# EAGLE design Meshtastic-DIY_v2 (EAGLE 9.6.2)
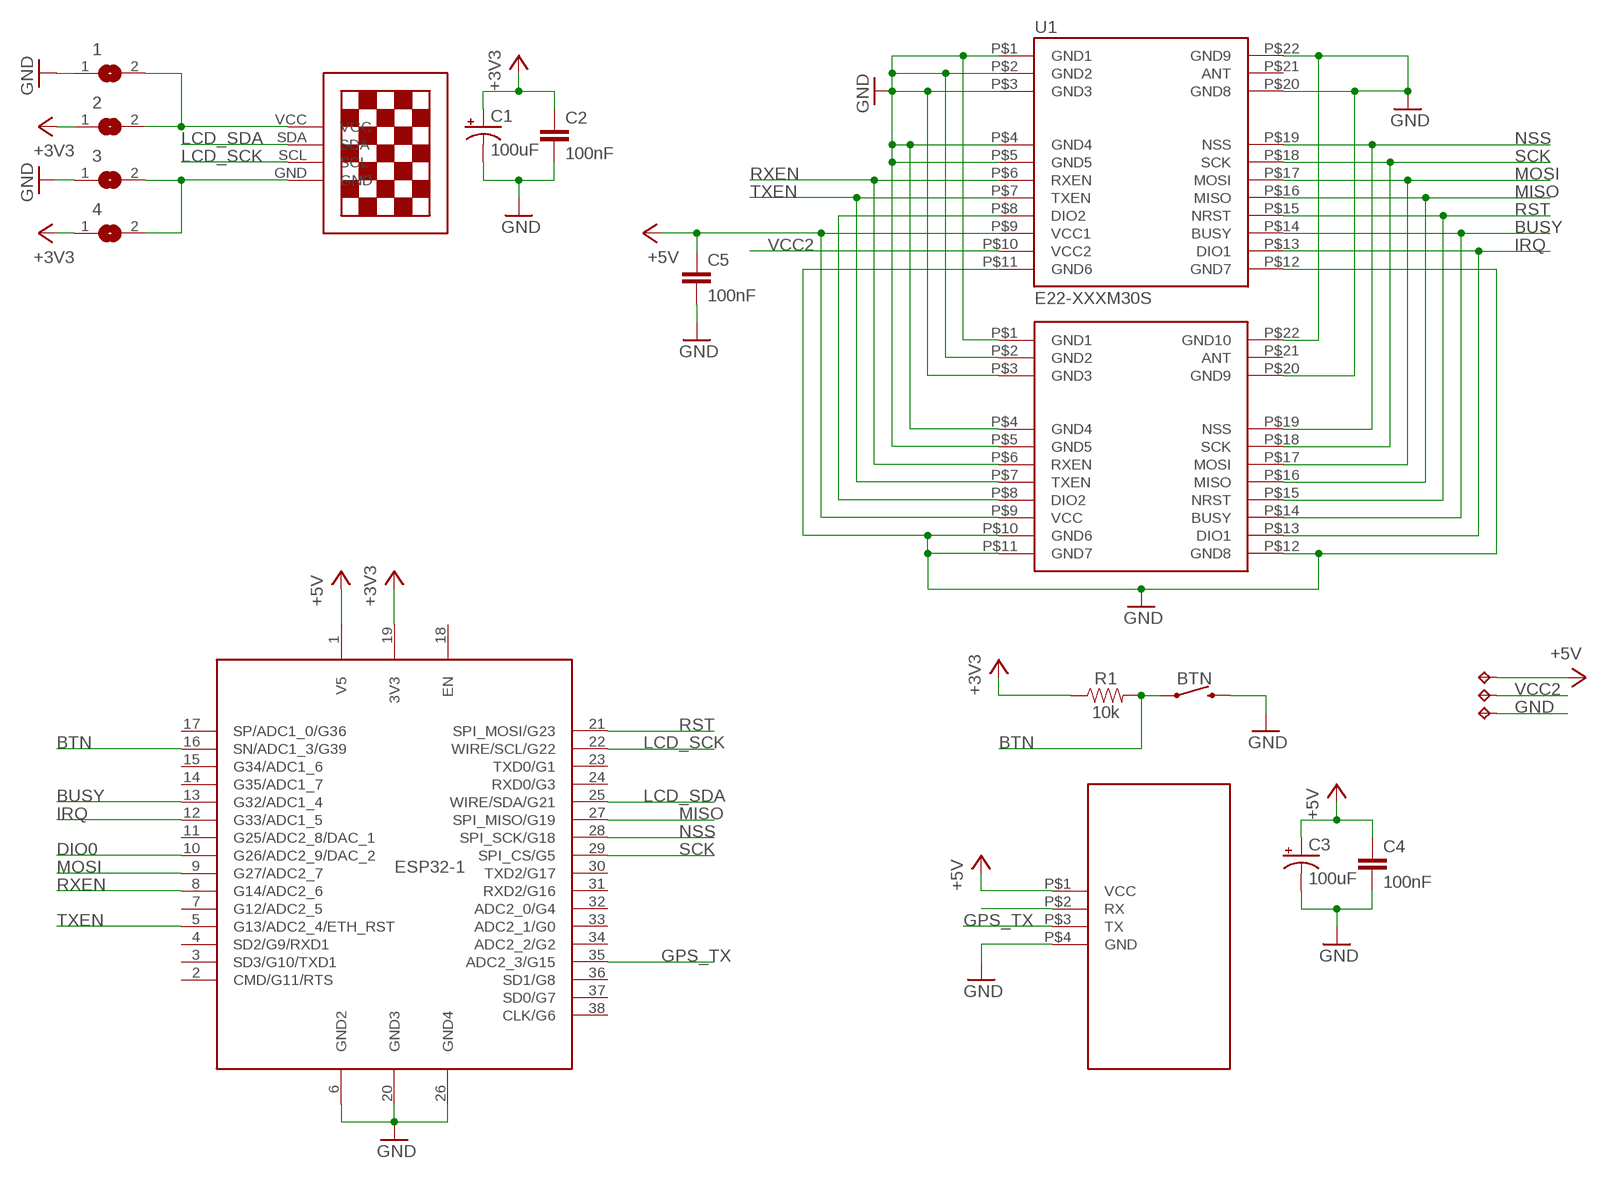
[diagram p0: schematic, sheet 1]

## Parts
1  SJ  [SJ]
2  SJ  [SJ]
3  SJ  [SJ]
4  SJ  [SJ]
BTN  MOMENTARY-SWITCH-SPST-PTH-6.0MM  [TACTILE_SWITCH_PTH_6.0MM]
C1  100uF  100UF-POLAR-EIA7343-10V-10%(TANT)  [EIA7343]
C2  100nF  0.33UF/330NF-0805-50V-10%  [0805]
C3  100uF  100UF-POLAR-EIA7343-10V-10%(TANT)  [EIA7343]
C4  100nF  0.33UF/330NF-0805-50V-10%  [0805]
C5  100nF  0.33UF/330NF-0805-50V-10%  [0805]
ESP32-1  NODEMCU_ESP32_WROOM_32  [NODEMCU_ESP32_WROOM_32--38PINS]
R1  10k  0.1OHM-1210-1/2W-1%  [1210]
TP1  TPTP14SQ  [TP14SQ]
TP2  TPTP14SQ  [TP14SQ]
TP3  TPTP14SQ  [TP14SQ]
U1  E22-XXXM30S  [E22-XXXM30S]
U$1  13"OLED13"OLED  [1.3"OLED]
U$2  E22-XXXM22S  [E22-XXXM22S]
U$3  GPS-NEO  [GPS-NEO]

## Nets
+3V3: 2.1 4.1 C1.A(+) C2.1 ESP32-1.19(3V3) R1.1
+5V: C3.A(+) C4.1 C5.1 ESP32-1.1(V5) TP1.TP U1.P$9(VCC1) U$2.P$9(VCC) U$3.P$1(VCC)
BTN: BTN.1 ESP32-1.16(SN/ADC1_3/G39) R1.2
BUSY: ESP32-1.13(G32/ADC1_4) U1.P$14(BUSY) U$2.P$14(BUSY)
DIO0: ESP32-1.10(G26/ADC2_9/DAC_2)
GND: 1.1 3.1 BTN.3 C1.C(-) C2.2 C3.C(-) C4.2 C5.2 ESP32-1.6(GND2) ESP32-1.20(GND3) ESP32-1.26(GND4) TP3.TP U1.P$1(GND1) U1.P$2(GND2) U1.P$3(GND3) U1.P$4(GND4) U1.P$5(GND5) U1.P$11(GND6) U1.P$12(GND7) U1.P$20(GND8) U1.P$22(GND9) U$2.P$1(GND1) U$2.P$2(GND2) U$2.P$3(GND3) U$2.P$4(GND4) U$2.P$5(GND5) U$2.P$10(GND6) U$2.P$11(GND7) U$2.P$12(GND8) U$2.P$20(GND9) U$2.P$22(GND10) U$3.P$4(GND)
GPS_TX: ESP32-1.35(ADC2_3/G15) U$3.P$3(TX)
IRQ: ESP32-1.12(G33/ADC1_5) U1.P$13(DIO1) U$2.P$13(DIO1)
LCD_SCK: ESP32-1.22(WIRE/SCL/G22) U$1.SCL
LCD_SDA: ESP32-1.25(WIRE/SDA/G21) U$1.SDA
MISO: ESP32-1.27(SPI_MISO/G19) U1.P$16(MISO) U$2.P$16(MISO)
MOSI: ESP32-1.9(G27/ADC2_7) U1.P$17(MOSI) U$2.P$17(MOSI)
N$1: 3.2 4.2 U$1.GND
N$3: U$3.P$2(RX)
N$4: 1.2 2.2 U$1.VCC
N$9: U1.P$8(DIO2) U$2.P$8(DIO2)
NSS: ESP32-1.28(SPI_SCK/G18) U1.P$19(NSS) U$2.P$19(NSS)
RST: ESP32-1.21(SPI_MOSI/G23) U1.P$15(NRST) U$2.P$15(NRST)
RXEN: ESP32-1.8(G14/ADC2_6) U1.P$6(RXEN) U$2.P$6(RXEN)
SCK: ESP32-1.29(SPI_CS/G5) U1.P$18(SCK) U$2.P$18(SCK)
TXEN: ESP32-1.5(G13/ADC2_4/ETH_RST) U1.P$7(TXEN) U$2.P$7(TXEN)
VCC2: TP2.TP U1.P$10(VCC2)
Unconnected: ESP32-1.3(SD3/G10/TXD1) ESP32-1.4(SD2/G9/RXD1) ESP32-1.7(G12/ADC2_5) ESP32-1.11(G25/ADC2_8/DAC_1) ESP32-1.14(G35/ADC1_7) ESP32-1.15(G34/ADC1_6) ESP32-1.17(SP/ADC1_0/G36) ESP32-1.18(EN) ESP32-1.23(TXD0/G1) ESP32-1.24(RXD0/G3) ESP32-1.30(TXD2/G17) ESP32-1.31(RXD2/G16) ESP32-1.32(ADC2_0/G4) ESP32-1.33(ADC2_1/G0) ESP32-1.34(ADC2_2/G2) ESP32-1.36(SD1/G8) ESP32-1.37(SD0/G7) ESP32-1.38(CLK/G6) U1.P$21(ANT) U$2.P$21(ANT)

## Power pins joined to a net without a drawn wire
CMD/G11/RTS: ESP32-1.2(CMD/G11/RTS)

## Library data of the parts
1-4 = jumper:SJ: SMD solder JUMPER
BTN = SparkFun-Switches:MOMENTARY-SWITCH-SPST: Momentary Switch (Pushbutton) - SPST Normally-open (NO) SPST momentary switches (buttons, pushbuttons). Variants PTH-12MM - 12mm square, through-hole Momentary Pushbutton Switch - 12mm Square <https://www.sparkfun.com/products/9190> (COM-09190) PTH-6.0MM, PTH-6.0MM-KIT - 6.0mm square, through-hole Mini Pushbutton Switch <https://www.sparkfun.com/products/97> (COM-00097) KIT package intended for soldering kit's - only one side of pads' copper is exposed. PTH-RIGHT-ANGLE-KIT - Right-angle, through-hole Right Angle Tactile Button <https://www.sparkfun.com/products/10791> - Used on SparkFun BigTime Watch Kit <https://www.sparkfun.com/products/11734> SMD-12MM - 12mm square, surface-mount Tactile Button - SMD (12mm) <https://www.sparkfun.com/products/12993> (COM-12993) Used on SparkFun PicoBoard <https://www.sparkfun.com/products/11888> SMD-4.5MM - 4.5mm Square Trackball Switch Used on SparkFun Blackberry Trackballer Breakout <https://www.sparkfun.com/products/13169> SMD-4.6MMX2.8MM - 4.60mm x 2.80mm, surface mount Used on SparkFun SAMD21 Mini Breakout <https://www.sparkfun.com/products/13664> SMD-5.2MM, SMD-5.2-REDUNDANT - 5.2mm square, surface-mount Mini Pushbutton Switch - SMD <https://www.sparkfun.com/products/8720> (COM-08720) Used on Arduino Pro Mini <https://www.sparkfun.com/products/11114> REDUNDANT package connects both switch circuits together SMD-6.0X3.5MM - 6.0 x 3.5mm, surface mount Momentary Reset Switch SMD <https://www.sparkfun.com/products/8229> (COM-08229) SMD-6.2MM-TALL - 6.2mm square, surface mount Tactile Button - SMD (6mm) <https://www.sparkfun.com/products/12992> Used on SparkFun Digital Sandbox <https://www.sparkfun.com/products/12651> SMD-RIGHT-ANGLE - Right-angle, surface mount Used on SparkFun Block for Intel® Edison - Arduino <https://www.sparkfun.com/products/13036>; PROD_ID: SWCH-08441; SF_SKU: COM-00097
C1 C3 = SparkFun-Capacitors:100UF-POLAR: 100µF polarized capacitors A capacitor is a passive two-terminal electrical component used to store electrical energy temporarily in an electric field.; PROD_ID: CAP-07890
C2 C4 C5 = SparkFun-Capacitors:0.33UF/330NF: 0.33µF/330nF ceramic capacitors A capacitor is a passive two-terminal electrical component used to store electrical energy temporarily in an electric field.; PROD_ID: CAP-08469; VALUE: 0.33µF
ESP32-1 = ESP32 NODEMCU WROOM 32:NODEMCU_ESP32_WROOM_32: NODEMCU ESP32 WROOM 32 38 Pins PINOUT: https://cdn.shopify.com/s/files/1/1509/1638/files/ESP_-_32_NodeMCU_Developmentboard_Pinout_Diagram.jpg?4479111012146266271; ESP: ESP32 WROOM 32
R1 = SparkFun-Resistors:0.1OHM: 0.1Ω resistor A resistor is a passive two-terminal electrical component that implements electrical resistance as a circuit element. Resistors act to reduce current flow, and, at the same time, act to lower voltage levels within circuits. - Wikipedia; PROD_ID: RES-12374; VALUE: 0.1
TP1-TP3 = testpad:TP: Test pad
U1 = E22-XXXMXXS:E22-XXXM30S
U$1 = 13oled:13"OLED
U$2 = E22-XXXMXXS:E22-XXXM22S
U$3 = 13oled:GPS-NEO

## Board
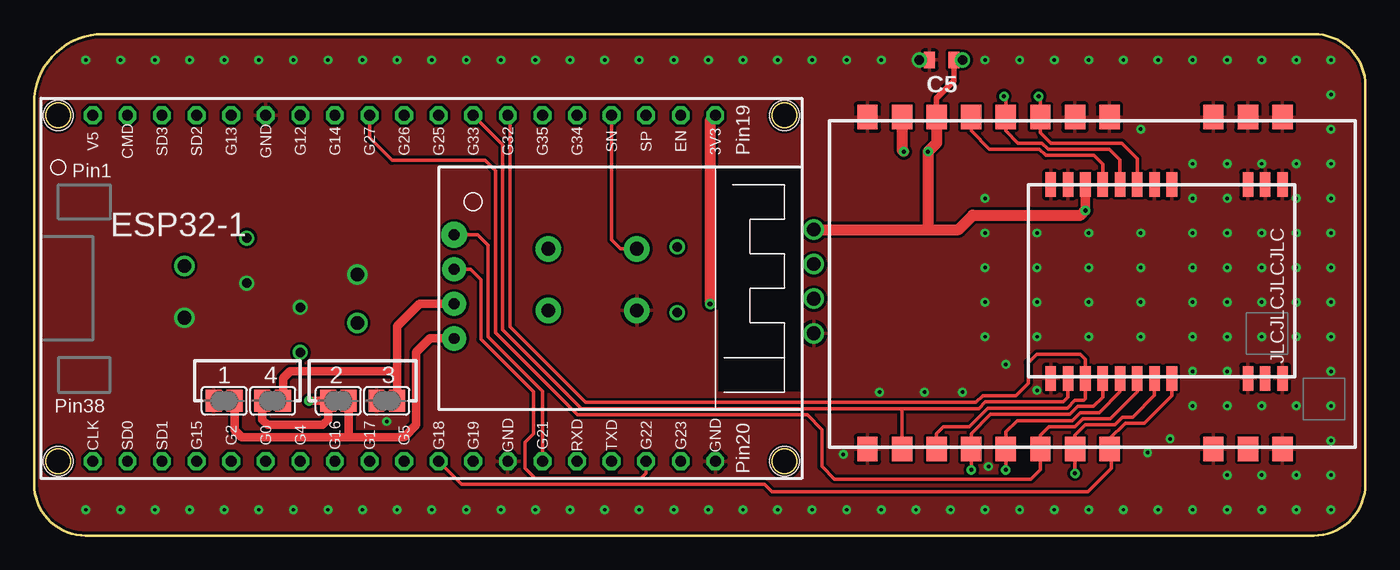
[diagram p1: board, top side]
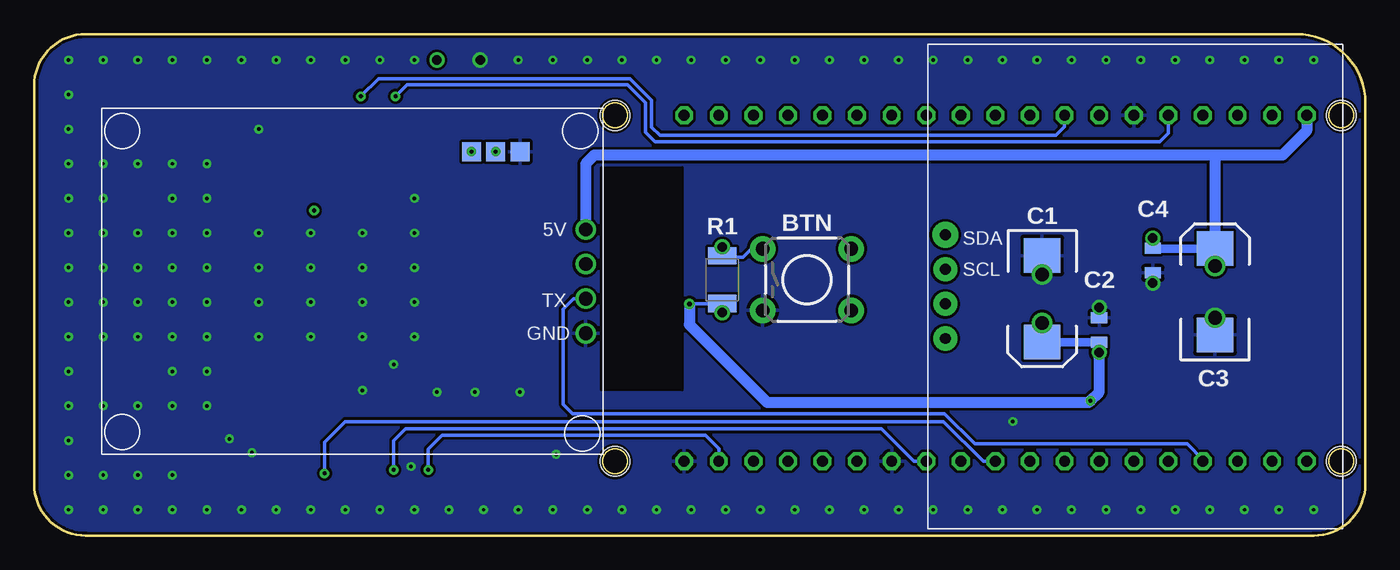
[diagram p2: board, bottom side, seen from below]

Size 97.79 x 36.83 mm. Coordinates in mm from the lower left corner, seen from the top.
Outline: 5.08,36.83 93.98,36.83 arc-90 97.79,33.02 97.79,3.81 arc-90 93.98,0 3.81,0 arc-90 0,3.81 0,31.75 arc-90 5.08,36.83
Copper layers (1*16): Top 0.035mm / dielectric 1.5mm / Bottom 0.035mm
Design rules "default *": minimum track width 0.2mm, minimum drill 0.25mm, track to track 0.2mm, track to pad 0.2mm, pad to pad 0.2mm, via to via 0.2mm, smd to smd 6mil, copper to edge 0.2mm, drill to drill 0.2mm, minimum pad ring 10mil, minimum via ring 8mil, stop-mask expansion 4mil, vias tented up to drill 0.35mm, thermal gap 10mil
Holes 2.2 mm at 1.78,30.86 1.78,5.46 55.12,5.46 55.12,30.86
tRestrict: area 50.3,10.7 to 56.3,27.1
bRestrict: area 50.2,10.7 to 56.1,27.1

### Footprints (pad centres in the part's own frame; a part is rotated, then mirrored left to right if it is on the bottom)
SJ = smd 1.168 x 1.6: 1 -0.762,0; 2 0.762,0
TACTILE_SWITCH_PTH_6.0MM = drill 1.016 pad 1.88: 1 -3.251,2.261; 2 3.251,2.261; 3 -3.251,-2.261; 4 3.251,-2.261
EIA7343 = smd 2.55 x 2.7: A 3.17,0; C -3.17,0
0805 = smd 0.8 x 1.2: 1 -0.9,0; 2 0.9,0
NODEMCU_ESP32_WROOM_32--38PINS = drill 0.8 octagon: 1 -13.97,-27.94; 2 -13.97,-25.4; 3 -13.97,-22.86; 4 -13.97,-20.32; 5 -13.97,-17.78; 6 -13.97,-15.24; 7 -13.97,-12.7; 8 -13.97,-10.16; 9 -13.97,-7.62; 10 -13.97,-5.08; 11 -13.97,-2.54; 12 -13.97,0; 13 -13.97,2.54; 14 -13.97,5.08; 15 -13.97,7.62; 16 -13.97,10.16; 17 -13.97,12.7; 18 -13.97,15.24; 19 -13.97,17.78; 20 11.43,17.78; 21 11.43,15.24; 22 11.43,12.7; 23 11.43,10.16; 24 11.43,7.62; 25 11.43,5.08; 26 11.43,2.54; 27 11.43,0; 28 11.43,-2.54; 29 11.43,-5.08; 30 11.43,-7.62; 31 11.43,-10.16; 32 11.43,-12.7; 33 11.43,-15.24; 34 11.43,-17.78; 35 11.43,-20.32; 36 11.43,-22.86; 37 11.43,-25.4; 38 11.43,-27.94
1210 = smd 1.27 x 2.06: 1 -1.755,0; 2 1.755,0
TP14SQ = smd 1.4 x 1.4: TP 0,0
E22-XXXM30S = smd 1.8 x 1.5: P$1 -11.938,15.24; P$2 -11.938,12.7; P$3 -11.938,10.16; P$4 -11.938,2.54; P$5 -11.938,0; P$6 -11.938,-2.54; P$7 -11.938,-5.08; P$8 -11.938,-7.62; P$9 -11.938,-10.16; P$10 -11.938,-12.7; P$11 -11.938,-15.24; P$12 12.446,-15.24; P$13 12.446,-12.7; P$14 12.446,-10.16; P$15 12.446,-7.62; P$16 12.446,-5.08; P$17 12.446,-2.54; P$18 12.446,0; P$19 12.446,2.54; P$20 12.446,10.16; P$21 12.446,12.7; P$22 12.446,15.24
1.3"OLED = drill 0.8 pad 1.778: GND 2.54,0; SCL 5.08,0; VCC 0,0 | drill 0.8 pad 1.9: SDA 7.62,0
E22-XXXM22S = smd 1.8 x 0.78: P$1 -6.858,8.763; P$2 -6.858,7.493; P$3 -6.858,6.223; P$4 -6.858,0.635; P$5 -6.858,-0.635; P$6 -6.858,-1.905; P$7 -6.858,-3.175; P$8 -6.858,-4.445; P$9 -6.858,-5.715; P$10 -6.858,-6.985; P$11 -6.858,-8.255; P$12 7.366,-8.255; P$13 7.366,-6.985; P$14 7.366,-5.715; P$15 7.366,-4.445; P$16 7.366,-3.175; P$17 7.366,-1.905; P$18 7.366,-0.635; P$19 7.366,0.635; P$20 7.366,6.223; P$21 7.366,7.493; P$22 7.366,8.763
GPS-NEO = drill 1: P$1 -3.81,16.51; P$2 -1.27,16.51; P$3 1.27,16.51; P$4 3.81,16.51

### Placement (x,y rotation side)
1  13.97,9.91 0 top
2  22.35,9.91 0 top
3  25.91,9.91 0 top
4  17.53,9.91 0 top
BTN  41.02,18.8 0 bottom
C1  23.75,17.4 270 bottom
C2  19.56,15.11 90 bottom
C3  11.05,17.91 90 bottom
C4  15.62,20.19 270 bottom
C5  66.67,34.92 180 top
ESP32-1  32.26,16.89 270 top
R1  47.24,18.8 90 bottom
TP1  65.66,28.19 0 bottom
TP2  63.88,28.19 0 bottom
TP3  62.1,28.19 0 bottom
U1  76.45,18.8 270 top
U$1  30.86,14.48 90 bottom
U$2  82.93,18.92 270 top
U$3  73.79,18.67 270 bottom

### Tracks (layer width: path | path; a pad name or v marks a point on that pad's centre or on a via)
+3V3  (via drill 0.3, 0.35, 0.7, 1)
  Top 0.61: 4.1 16.76,8.51 17.14,8.13 21.21,8.13 21.59,8.51 2.1 v20.19,9.91
  Top 0.813: v49.66,17.02 49.66,30.48 ESP32-1.19
  Bottom 0.2: R1.1 v47.24,16.38 | v19.56,13.46 19.56,13.97 C2.1
  Bottom 0.254: R1.1 49.63,17.04 v49.66,17.02
  Bottom 0.61: C2.1 23.76,14.21 24.13,13.84 24.13,13.85 C1.A
  Bottom 0.813: v49.66,17.02 49.66,15.49 43.94,9.78 20.32,9.78 v20.19,9.91 19.56,10.54 19.56,13.97 | v23.75,15.62 C1.A 23.76,14.21
+5V  (via drill 0.3, 0.7, 1)
  Top 0.2: C5.1 v68.2,34.92
  Top 0.406: U1.P$9 66.29,32.12 67.57,33.4 C5.1
  Top 0.7: U$2.P$9 v77.22,23.88
  Top 0.813: U1.P$9 66.29,28.83 TP1.TP 65.66,22.48 | U$3.P$1 65.66,22.48 | 65.66,22.48 67.89,22.48 68.95,23.54 76.88,23.54 v77.22,23.88
  Bottom 0.2: v15.62,21.84 C4.1
  Bottom 0.406: v11.05,19.81 C3.A
  Bottom 0.61: U$3.P$1 | C3.A 15.6,21.08 C4.1
  Bottom 0.813: ESP32-1.1 4.32,29.72 6.1,27.94 11.05,27.94 | 11.05,27.94 C3.A | 11.05,27.94 56.64,27.94 57.28,27.3 U$3.P$1
  other vias: 65.66,28.19
BTN  (via drill 0.7)
  Top 0.254: ESP32-1.16 42.42,21.72 43.08,21.06 BTN.1
  Bottom 0.2: R1.2 v47.24,21.21
  Bottom 0.254: BTN.1 45.11,21.06 45.72,20.45 47.14,20.45 R1.2
BUSY
  Top 0.254: ESP32-1.13 34.95,30.71 34.95,15.34 40.51,9.78 69.19,9.78 69.69,10.27 72.12,10.27 73.02,11.18 73.02,12.7 73.66,13.33 76.83,13.33 77.22,12.95 U$2.P$14 77.22,10.07 77.09,9.94 76.46,9.94 75.88,9.36 70.06,9.36 68.7,8 66.8,8 66.29,7.49 U1.P$14
GND  (via drill 0.25, 0.7, 1)
  Top 0.2: v65.02,34.92 C5.2
  Bottom 0.2: C1.C v23.75,19.18 | C4.2 v15.62,18.54 | v19.56,16.76 C2.2
  other vias: 73.66,10.67 70.1,5.08 68.2,10.54 65.41,10.54 62.1,10.54 71.37,12.57 83.44,7.11 81.79,6.1 90.17,17.14 92.71,17.14 95.25,17.14 87.63,17.14 85.09,17.14 81.28,17.14 81.28,14.61 85.09,14.61 87.63,14.61 90.17,14.61 92.71,14.61 95.25,14.61 95.25,12.06 87.63,12.06 85.09,12.06 87.63,9.53 90.17,9.53 92.71,9.53 95.25,9.53 81.28,19.68 81.28,22.23 85.09,22.23 87.63,22.23 90.17,22.23 92.71,22.23 95.25,22.23 85.09,19.68 87.63,19.68 90.17,19.68 92.71,19.68 95.25,19.68 85.09,24.77 87.63,24.77 85.09,27.3 87.63,27.3 90.17,27.3 92.71,27.3 95.25,27.3 95.25,24.77 92.71,24.77 59.44,5.97 87.63,4.44 90.17,4.44 92.71,4.44 95.25,4.44 95.25,6.98 95.25,1.91 92.71,1.91 90.17,1.91 87.63,1.91 85.09,1.91 82.55,1.91 80.01,1.91 77.47,1.91 74.93,1.91 72.39,1.91 69.85,1.91 67.31,1.91 64.77,1.91 62.23,1.91 59.69,1.91 57.15,1.91 54.61,1.91 52.07,1.91 49.53,1.91 46.99,1.91 44.45,1.91 41.91,1.91 39.37,1.91 36.83,1.91 34.29,1.91 31.75,1.91 29.21,1.91 26.67,1.91 24.13,1.91 21.59,1.91 19.05,1.91 16.51,1.91 13.97,1.91 11.43,1.91 8.89,1.91 6.35,1.91 3.81,1.91 95.25,29.84 95.25,32.38 95.25,34.92 92.71,34.92 90.17,34.92 87.63,34.92 85.09,34.92 82.55,34.92 80.01,34.92 77.47,34.92 74.93,34.92 72.39,34.92 69.85,34.92 62.23,34.92 59.69,34.92 57.15,34.92 54.61,34.92 52.07,34.92 49.53,34.92 46.99,34.92 44.45,34.92 41.91,34.92 39.37,34.92 36.83,34.92 34.29,34.92 31.75,34.92 29.21,34.92 26.67,34.92 24.13,34.92 21.59,34.92 19.05,34.92 16.51,34.92 13.97,34.92 11.43,34.92 8.89,34.92 6.35,34.92 3.81,34.92 77.47,14.61 73.66,14.61 69.85,14.61 77.47,17.14 73.66,17.14 69.85,17.14 77.47,19.68 73.66,19.68 77.47,22.23 85.09,9.53 81.28,29.84 73.66,22.23 69.85,22.23 69.85,19.68 69.85,24.77 11.05,16 25.91,8.38
  pour Top: 0,37.34 0,-0.76 97.92,-0.76 97.92,37.34
  pour Bottom: 0,37.46 0,-1.02 97.79,-1.02 97.79,37.46
GPS_TX
  Bottom 0.2: ESP32-1.35 11.94,5.59
  Bottom 0.254: U$3.P$3 58.17,17.4 58.93,16.64 58.93,9.65 58.24,8.96 30.93,8.96 28.69,6.73 13.08,6.73 11.94,5.59
IRQ
  Top 0.254: ESP32-1.12 34.42,28.7 34.42,15.11 40.21,9.32 63.75,9.32 | U$2.P$13 75.95,10.16 75.6,9.82 69.87,9.82 69.38,9.32 63.75,9.32 | U1.P$13 63.75,9.32
LCD_SCK
  Top 0.254: U$1.SCL 32.05,19.56 32.82,18.8 32.82,14.42 36.68,10.56 36.68,7.47 36.07,6.86 36.07,4.95 36.8,4.22 44.58,4.22 44.96,4.6 ESP32-1.22
LCD_SDA
  Top 0.254: U$1.SDA 32.59,22.1 33.35,21.34 33.35,14.59 37.34,10.6 ESP32-1.25
MISO  (via drill 0.3)
  Top 0.254: U$2.P$16 79.76,10.56 78.23,9.04 76.84,9.04 76.26,8.46 72.21,8.46 71.37,7.62 U1.P$16 v71.37,4.83
  Bottom 0.254: ESP32-1.27 33.15,5.46 35.03,7.35 35.05,7.35 35.56,7.86 70.5,7.86 71.37,6.98 v71.37,4.83
MOSI
  Top 0.254: ESP32-1.9 24.64,29.21 26.29,27.56 33.12,27.56 33.88,26.8 33.88,14.88 39.9,8.87 56.79,8.87 57.87,7.79 57.87,5.08 58.8,4.15 73.23,4.15 73.91,4.83 U1.P$17 73.91,7.37 74.55,8 76.45,8 77.03,8.58 79.05,8.58 81.03,10.55 U$2.P$17
N$1
  Top 0.61: 3.2 26.8,9.78 | 4.2 18.29,11.56 18.8,12.06 26.67,12.06 3.2 | U$1.GND 28.32,17.02 26.67,15.37 3.2
N$4
  Top 0.61: 1.2 14.73,7.75 15.24,7.24 23.11,7.24 | U$1.VCC 29.08,14.48 28.07,13.46 28.07,8.13 27.18,7.24 23.11,7.24 | 2.2 23.11,7.24
N$9
  Top 0.254: U$2.P$8 78.49,27.29 77.85,27.92 74.3,27.92 73.85,28.38 70.18,28.38 68.83,29.72 U1.P$8
NSS
  Top 0.254: U$2.P$19 83.57,10.29 81.53,8.25 80.14,8.25 78.99,7.11 U1.P$19 79.12,6.22 79.12,4.95 77.39,3.22 54.19,3.22 53.65,3.76 31.42,3.76 ESP32-1.28
RST  (via drill 0.3)
  Top 0.254: U$2.P$15 78.49,10.16 77.82,9.49 76.65,9.49 76.07,8.91 70.25,8.91 68.83,7.49 U1.P$15 v68.83,4.83
  Bottom 0.254: ESP32-1.21 47.5,6.38 48.48,7.37 67.82,7.37 U1.P$15 v68.83,4.83
RXEN  (via drill 0.3)
  Top 0.254: U$2.P$6 81.03,27.69 79.88,28.83 74.68,28.83 73.91,29.59 U1.P$6 73.91,32.13 v73.79,32.26
  Bottom 0.254: ESP32-1.8 22.1,30.02 22.73,29.38 51.83,29.38 52.42,29.97 52.42,31.98 54,33.56 72.49,33.56 v73.79,32.26
SCK  (via drill 0.3)
  Top 0.254: U$2.P$18 82.3,10.29 80.71,8.71 79.95,8.71 79.37,8.13 77.22,8.13 76.45,7.37 U1.P$18 v76.45,4.57
  Bottom 0.254: ESP32-1.29 28.07,5.46 30.99,8.38 74.93,8.38 76.45,6.86 v76.45,4.57
TXEN  (via drill 0.3)
  Top 0.254: U$2.P$7 79.76,27.61 78.99,28.38 74.49,28.38 74.03,28.83 72.26,28.83 71.37,29.72 U1.P$7 71.37,32.13 v71.25,32.26
  Bottom 0.254: ESP32-1.5 14.48,29.56 15.11,28.93 52.17,28.93 52.88,29.63 52.88,31.79 54.19,33.1 70.4,33.1 v71.25,32.26
VCC2  (via drill 0.3)
  Top 0.813: U1.P$10 63.75,28.32 TP2.TP
  other vias: 63.88,28.19

### Text on the board
tNames: JLCJLCJLCJLC
bNames: 5V | SDA | SCL | TX | GND